# Altium project PR003.PrjPcb (part 1 of 11)
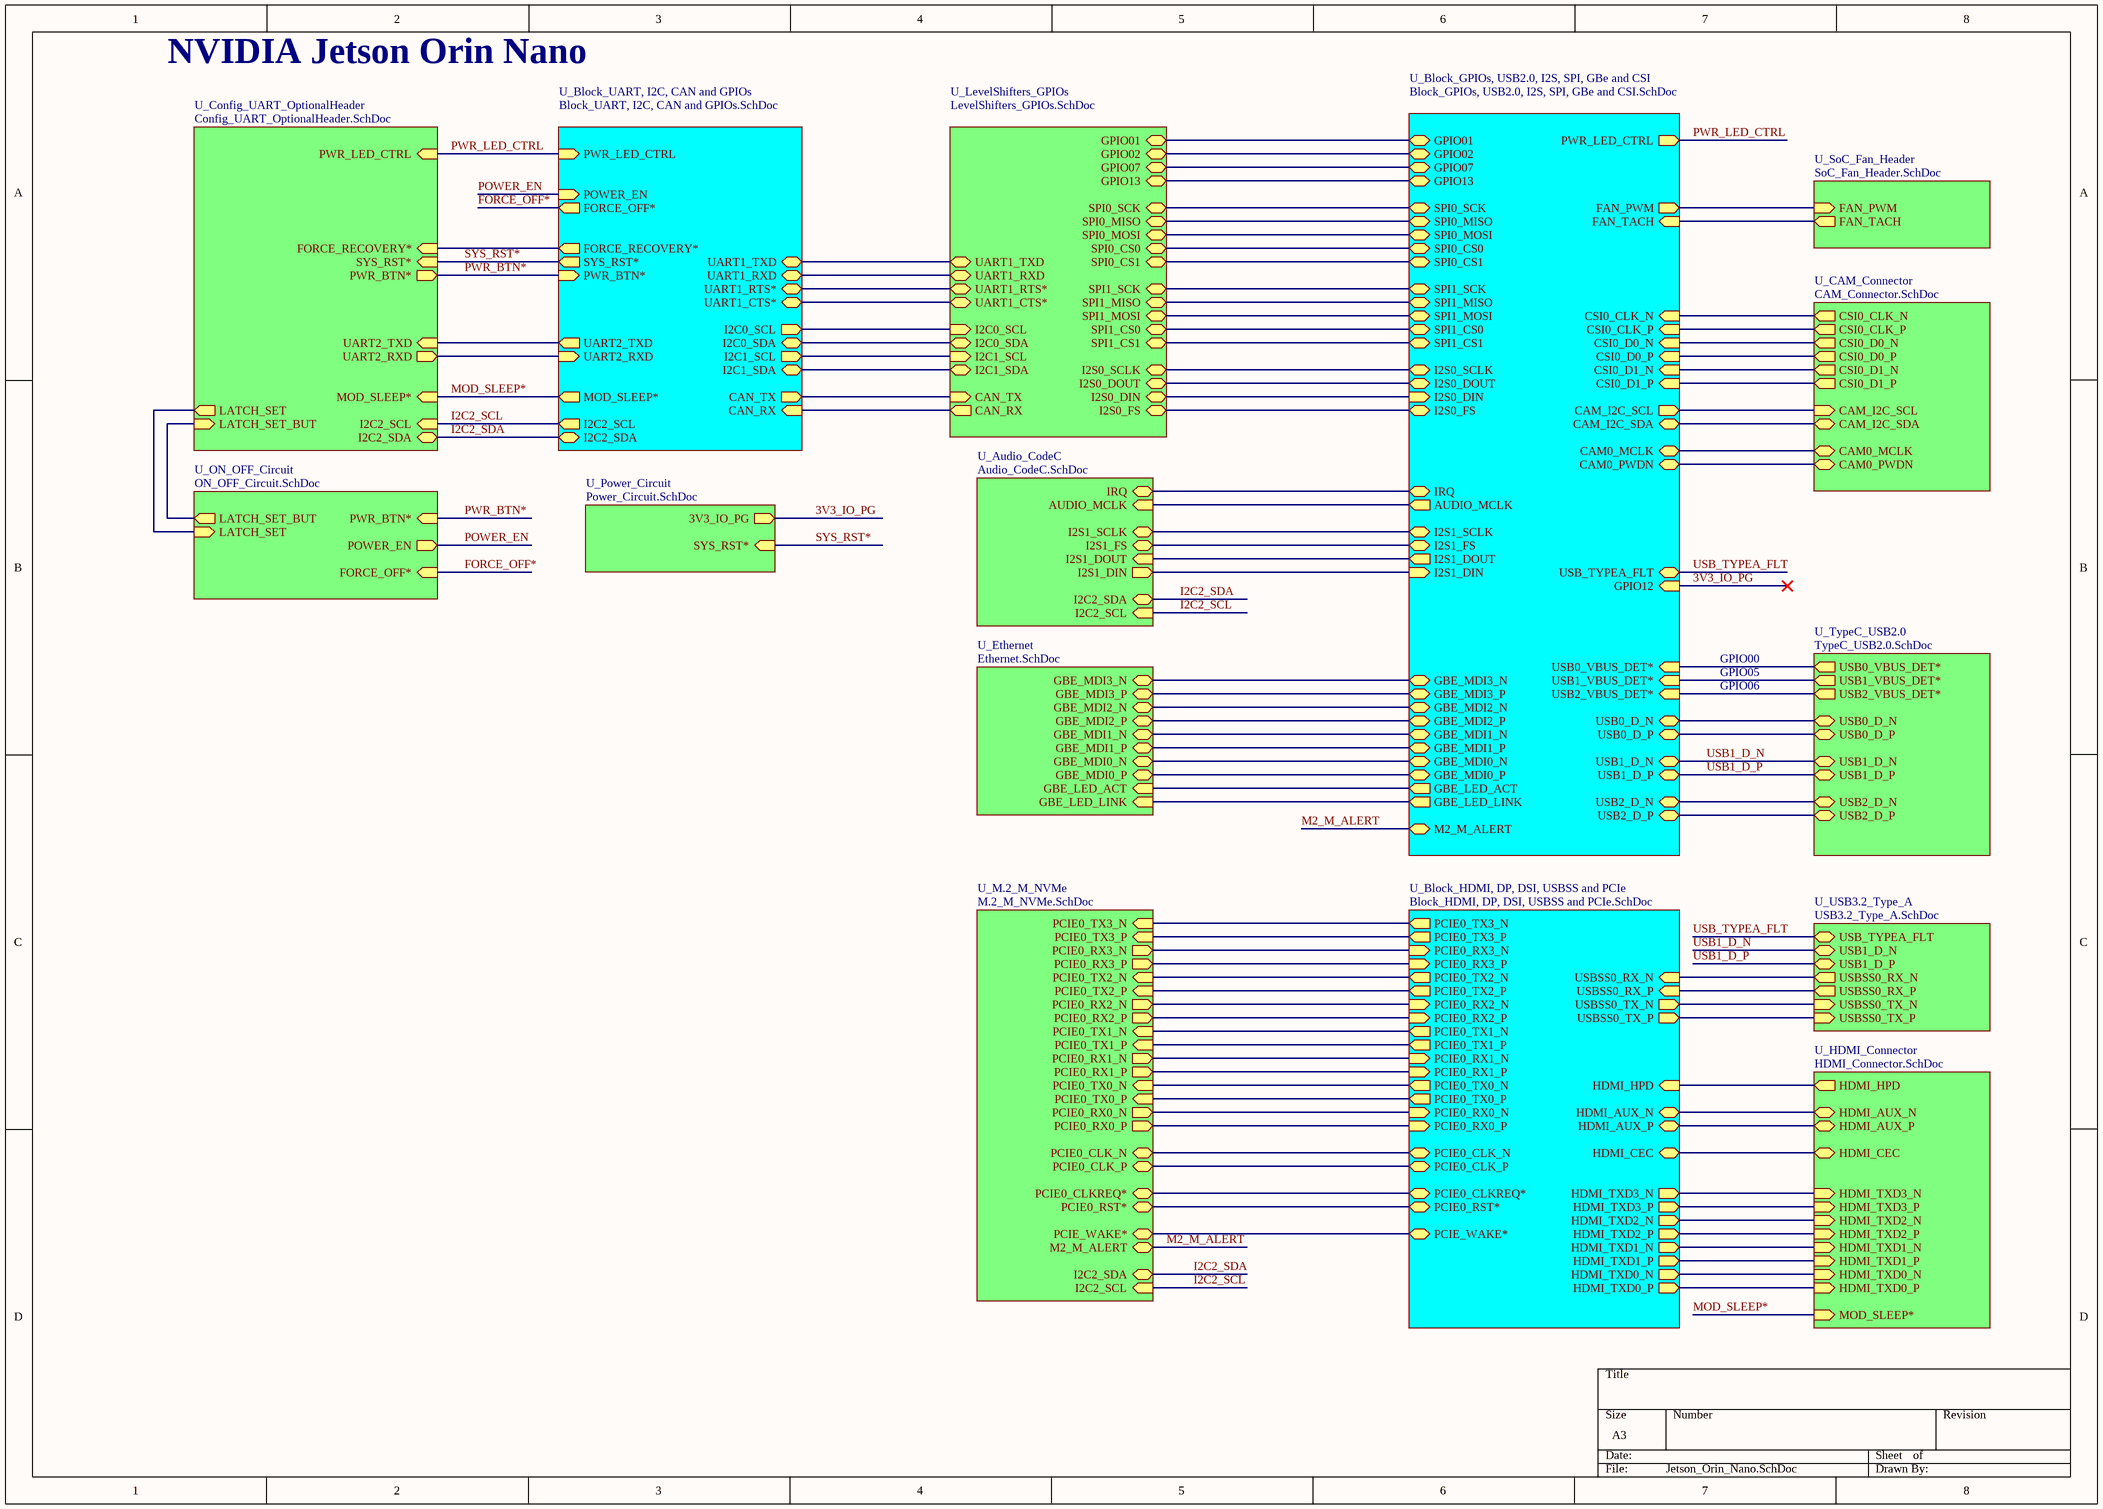
[diagram p0: Jetson_Orin_Nano.SchDoc]
16 sheets, 481 parts. Net scope: hierarchical (ports join the sheet entries above them; power ports are global).
Sheets:
  Jetson_Orin_Nano.SchDoc
    U_Block_GPIOs, USB2.0, I2S, SPI, GBe and CSI = Block_GPIOs, USB2.0, I2S, SPI, GBe and CSI.SchDoc
    U_Block_HDMI, DP, DSI, USBSS and PCIe = Block_HDMI, DP, DSI, USBSS and PCIe.SchDoc
    U_TypeC_USB2.0 = TypeC_USB2.0.SchDoc
    U_USB3.2_Type_A = USB3.2_Type_A.SchDoc
    U_M.2_M_NVMe = M.2_M_NVMe.SchDoc
    U_Ethernet = Ethernet.SchDoc
    U_HDMI_Connector = HDMI_Connector.SchDoc
    U_Block_UART, I2C, CAN and GPIOs = Block_UART, I2C, CAN and GPIOs.SchDoc
    U_Audio_CodeC = Audio_CodeC.SchDoc
    U_LevelShifters_GPIOs = LevelShifters_GPIOs.SchDoc
    U_SoC_Fan_Header = SoC_Fan_Header.SchDoc
    U_Config_UART_OptionalHeader = Config_UART_OptionalHeader.SchDoc
    U_Power_Circuit = Power_Circuit.SchDoc
    U_ON_OFF_Circuit = ON_OFF_Circuit.SchDoc
    U_CAM_Connector = CAM_Connector.SchDoc

## Sheet Jetson_Orin_Nano.SchDoc
size A3; SheetNumber: 1; SheetTotal: 16

### Sub-sheets
U_Audio_CodeC = Audio_CodeC.SchDoc: I2S1_SCLK (bidir), I2S1_DOUT (in), I2S1_FS (bidir), I2S1_DIN (out), AUDIO_MCLK (in), I2C2_SDA (bidir), I2C2_SCL (in), IRQ (bidir)
U_Block_GPIOs, USB2.0, I2S, SPI, GBe and CSI = Block_GPIOs, USB2.0, I2S, SPI, GBe and CSI.SchDoc: M2_M_ALERT (bidir), USB0_VBUS_DET* (in), I2S1_FS (bidir), I2S1_DOUT (out), I2S1_SCLK (bidir), I2S1_DIN (in), GBE_LED_LINK (out), GBE_LED_ACT (out), GBE_MDI3_N (bidir), GBE_MDI1_N (bidir), PWR_LED_CTRL (out), GPIO13 (bidir), AUDIO_MCLK (out), IRQ (bidir), SPI0_SCK (bidir), SPI0_MOSI (bidir), FAN_PWM (out), FAN_TACH (in), GPIO07 (bidir), SPI0_MISO (bidir), SPI1_SCK (bidir), SPI1_MOSI (bidir), SPI1_MISO (bidir), SPI1_CS0 (bidir), SPI1_CS1 (bidir), SPI0_CS0 (bidir), SPI0_CS1 (bidir), I2S0_FS (bidir), I2S0_SCLK (bidir), I2S0_DIN (in), I2S0_DOUT (bidir), GPIO02 (bidir), GPIO01 (bidir), CSI0_D0_P (in), CSI0_D0_N (in), CSI0_D1_P (in), CSI0_D1_N (in), CSI0_CLK_P (in), CSI0_CLK_N (in), CAM_I2C_SDA (bidir), CAM_I2C_SCL (out), CAM0_PWDN (bidir), CAM0_MCLK (bidir), USB_TYPEA_FLT (bidir), USB1_VBUS_DET* (in), USB2_VBUS_DET* (in), GPIO12 (in), GBE_MDI0_P (bidir), GBE_MDI0_N (bidir), GBE_MDI1_P (bidir), GBE_MDI2_P (bidir), GBE_MDI2_N (bidir), GBE_MDI3_P (bidir), USB2_D_N (bidir), USB1_D_P (bidir), USB0_D_N (bidir), USB0_D_P (bidir), USB2_D_P (bidir), USB1_D_N (bidir)
U_Block_HDMI, DP, DSI, USBSS and PCIe = Block_HDMI, DP, DSI, USBSS and PCIe.SchDoc: PCIE0_TX3_N (out), PCIE0_TX3_P (out), PCIE0_TX2_N (out), PCIE0_TX2_P (out), USBSS0_RX_N (in), USBSS0_TX_P (out), USBSS0_TX_N (out), USBSS0_RX_P (in), PCIE0_RX0_P (in), PCIE0_TX0_N (out), PCIE0_CLKREQ* (bidir), PCIE0_RST* (bidir), PCIE0_CLK_P (bidir), PCIE0_RX0_N (in), PCIE0_TX0_P (out), PCIE0_CLK_N (bidir), PCIE0_RX3_N (in), PCIE0_RX3_P (in), PCIE0_RX2_N (in), PCIE0_RX2_P (in), HDMI_CEC (bidir), PCIE_WAKE* (bidir), PCIE0_RX1_P (in), PCIE0_RX1_N (in), PCIE0_TX1_N (out), PCIE0_TX1_P (out), HDMI_TXD3_N (out), HDMI_TXD0_P (out), HDMI_TXD1_P (out), HDMI_AUX_P (bidir), HDMI_AUX_N (bidir), HDMI_TXD1_N (out), HDMI_TXD0_N (out), HDMI_TXD2_P (out), HDMI_HPD (in), HDMI_TXD3_P (out), HDMI_TXD2_N (out)
U_Block_UART, I2C, CAN and GPIOs = Block_UART, I2C, CAN and GPIOs.SchDoc: I2C1_SCL (out), I2C2_SCL (out), I2C1_SDA (bidir), I2C2_SDA (bidir), PWR_BTN* (in), PWR_LED_CTRL (in), UART1_TXD (bidir), UART1_RXD (bidir), UART2_TXD (out), UART2_RXD (in), CAN_RX (in), CAN_TX (out), MOD_SLEEP* (out), SYS_RST* (out), FORCE_RECOVERY* (out), I2C0_SCL (out), I2C0_SDA (bidir), UART1_RTS* (bidir), UART1_CTS* (bidir), POWER_EN (in), FORCE_OFF* (out)
U_CAM_Connector = CAM_Connector.SchDoc: CSI0_D0_N (out), CSI0_D0_P (out), CSI0_D1_N (out), CSI0_D1_P (out), CSI0_CLK_N (out), CSI0_CLK_P (out), CAM0_PWDN (bidir), CAM0_MCLK (bidir), CAM_I2C_SCL (in), CAM_I2C_SDA (bidir)
U_Config_UART_OptionalHeader = Config_UART_OptionalHeader.SchDoc: UART2_RXD (out), UART2_TXD (in), PWR_LED_CTRL (in), MOD_SLEEP* (in), SYS_RST* (in), FORCE_RECOVERY* (in), PWR_BTN* (out), I2C2_SCL (in), I2C2_SDA (bidir), LATCH_SET_BUT (in), LATCH_SET (out)
U_Ethernet = Ethernet.SchDoc: GBE_MDI0_P (bidir), GBE_MDI0_N (bidir), GBE_MDI1_P (bidir), GBE_MDI1_N (bidir), GBE_MDI2_P (bidir), GBE_MDI2_N (bidir), GBE_MDI3_P (bidir), GBE_MDI3_N (bidir), GBE_LED_LINK (in), GBE_LED_ACT (in)
U_HDMI_Connector = HDMI_Connector.SchDoc: HDMI_TXD0_P (in), HDMI_HPD (out), HDMI_AUX_N (bidir), HDMI_AUX_P (bidir), HDMI_CEC (bidir), HDMI_TXD3_N (in), HDMI_TXD3_P (in), HDMI_TXD2_N (in), HDMI_TXD2_P (in), HDMI_TXD1_N (in), HDMI_TXD1_P (in), HDMI_TXD0_N (in), MOD_SLEEP* (in)
U_LevelShifters_GPIOs = LevelShifters_GPIOs.SchDoc: SPI0_SCK (bidir), SPI0_MISO (bidir), SPI0_MOSI (bidir), SPI0_CS0 (bidir), SPI0_CS1 (bidir), SPI1_SCK (bidir), SPI1_MISO (bidir), SPI1_MOSI (bidir), SPI1_CS0 (bidir), SPI1_CS1 (bidir), I2C1_SDA (bidir), I2C1_SCL (in), I2C0_SCL (in), I2C0_SDA (bidir), CAN_TX (in), I2S0_SCLK (bidir), I2S0_FS (bidir), I2S0_DIN (bidir), CAN_RX (out), UART1_RXD (bidir), GPIO13 (bidir), GPIO01 (bidir), GPIO02 (bidir), GPIO07 (bidir), UART1_CTS* (bidir), UART1_RTS* (bidir), UART1_TXD (bidir), I2S0_DOUT (bidir)
U_M.2_M_NVMe = M.2_M_NVMe.SchDoc: PCIE0_TX0_P (in), PCIE0_TX0_N (in), PCIE0_RX1_P (out), PCIE0_RX1_N (out), PCIE0_TX1_P (in), PCIE0_TX1_N (in), PCIE0_RX2_P (out), PCIE0_RX2_N (out), PCIE0_TX2_P (in), PCIE0_TX2_N (in), PCIE0_RX3_P (out), PCIE0_RX3_N (out), PCIE0_TX3_P (in), PCIE0_TX3_N (in), PCIE0_RST* (bidir), PCIE0_CLKREQ* (bidir), I2C2_SCL (in), I2C2_SDA (bidir), PCIE_WAKE* (bidir), PCIE0_RX0_P (out), PCIE0_RX0_N (out), PCIE0_CLK_N (bidir), PCIE0_CLK_P (bidir), M2_M_ALERT (bidir)
U_ON_OFF_Circuit = ON_OFF_Circuit.SchDoc: PWR_BTN* (in), POWER_EN (out), FORCE_OFF* (in), LATCH_SET_BUT (out), LATCH_SET (in)
U_Power_Circuit = Power_Circuit.SchDoc: 3V3_IO_PG (out), SYS_RST* (in)
U_SoC_Fan_Header = SoC_Fan_Header.SchDoc: FAN_TACH (out), FAN_PWM (in)
U_TypeC_USB2.0 = TypeC_USB2.0.SchDoc: USB0_VBUS_DET* (out), USB0_D_P (bidir), USB0_D_N (bidir), USB1_VBUS_DET* (out), USB1_D_N (bidir), USB1_D_P (bidir), USB2_VBUS_DET* (out), USB2_D_N (bidir), USB2_D_P (bidir)
U_USB3.2_Type_A = USB3.2_Type_A.SchDoc: USB_TYPEA_FLT (bidir), USBSS0_RX_N (out), USBSS0_RX_P (out), USB1_D_N (bidir), USB1_D_P (bidir), USBSS0_TX_N (in), USBSS0_TX_P (in)

### Nets
3V3_IO_PG: sheet U_Block_GPIOs, USB2.0, I2S, SPI, GBe and CSI/GPIO12, sheet U_Power_Circuit/3V3_IO_PG
CAM_I2C_SCL: sheet U_Block_GPIOs, USB2.0, I2S, SPI, GBe and CSI/CAM_I2C_SCL, sheet U_CAM_Connector/CAM_I2C_SCL
CAM_I2C_SDA: sheet U_Block_GPIOs, USB2.0, I2S, SPI, GBe and CSI/CAM_I2C_SDA, sheet U_CAM_Connector/CAM_I2C_SDA
FORCE_OFF*: sheet U_Block_UART, I2C, CAN and GPIOs/FORCE_OFF*, sheet U_ON_OFF_Circuit/FORCE_OFF*
I2C0_SCL: sheet U_Block_UART, I2C, CAN and GPIOs/I2C0_SCL, sheet U_LevelShifters_GPIOs/I2C0_SCL
I2C0_SDA: sheet U_Block_UART, I2C, CAN and GPIOs/I2C0_SDA, sheet U_LevelShifters_GPIOs/I2C0_SDA
I2C1_SCL: sheet U_Block_UART, I2C, CAN and GPIOs/I2C1_SCL, sheet U_LevelShifters_GPIOs/I2C1_SCL
I2C1_SDA: sheet U_Block_UART, I2C, CAN and GPIOs/I2C1_SDA, sheet U_LevelShifters_GPIOs/I2C1_SDA
I2C2_SCL: sheet U_M.2_M_NVMe/I2C2_SCL, sheet U_Block_UART, I2C, CAN and GPIOs/I2C2_SCL, sheet U_Audio_CodeC/I2C2_SCL, sheet U_Config_UART_OptionalHeader/I2C2_SCL
I2C2_SDA: sheet U_M.2_M_NVMe/I2C2_SDA, sheet U_Block_UART, I2C, CAN and GPIOs/I2C2_SDA, sheet U_Audio_CodeC/I2C2_SDA, sheet U_Config_UART_OptionalHeader/I2C2_SDA
LATCH_SET: sheet U_Config_UART_OptionalHeader/LATCH_SET, sheet U_ON_OFF_Circuit/LATCH_SET
LATCH_SET_BUT: sheet U_Config_UART_OptionalHeader/LATCH_SET_BUT, sheet U_ON_OFF_Circuit/LATCH_SET_BUT
M2_M_ALERT: sheet U_Block_GPIOs, USB2.0, I2S, SPI, GBe and CSI/M2_M_ALERT, sheet U_M.2_M_NVMe/M2_M_ALERT
MOD_SLEEP*: sheet U_HDMI_Connector/MOD_SLEEP*, sheet U_Block_UART, I2C, CAN and GPIOs/MOD_SLEEP*, sheet U_Config_UART_OptionalHeader/MOD_SLEEP*
POWER_EN: sheet U_Block_UART, I2C, CAN and GPIOs/POWER_EN, sheet U_ON_OFF_Circuit/POWER_EN
PWR_BTN*: sheet U_Block_UART, I2C, CAN and GPIOs/PWR_BTN*, sheet U_Config_UART_OptionalHeader/PWR_BTN*, sheet U_ON_OFF_Circuit/PWR_BTN*
PWR_LED_CTRL: sheet U_Block_GPIOs, USB2.0, I2S, SPI, GBe and CSI/PWR_LED_CTRL, sheet U_Block_UART, I2C, CAN and GPIOs/PWR_LED_CTRL, sheet U_Config_UART_OptionalHeader/PWR_LED_CTRL
SYS_RST*: sheet U_Block_UART, I2C, CAN and GPIOs/SYS_RST*, sheet U_Config_UART_OptionalHeader/SYS_RST*, sheet U_Power_Circuit/SYS_RST*
USB0_AP_N: sheet U_Block_GPIOs, USB2.0, I2S, SPI, GBe and CSI/USB0_D_N, sheet U_TypeC_USB2.0/USB0_D_N
USB0_AP_P: sheet U_Block_GPIOs, USB2.0, I2S, SPI, GBe and CSI/USB0_D_P, sheet U_TypeC_USB2.0/USB0_D_P
USB1_D_N: sheet U_Block_GPIOs, USB2.0, I2S, SPI, GBe and CSI/USB1_D_N, sheet U_TypeC_USB2.0/USB1_D_N, sheet U_USB3.2_Type_A/USB1_D_N
USB1_D_P: sheet U_Block_GPIOs, USB2.0, I2S, SPI, GBe and CSI/USB1_D_P, sheet U_TypeC_USB2.0/USB1_D_P, sheet U_USB3.2_Type_A/USB1_D_P
USB2_AP_N: sheet U_Block_GPIOs, USB2.0, I2S, SPI, GBe and CSI/USB2_D_N, sheet U_TypeC_USB2.0/USB2_D_N
USB2_AP_P: sheet U_Block_GPIOs, USB2.0, I2S, SPI, GBe and CSI/USB2_D_P, sheet U_TypeC_USB2.0/USB2_D_P
USB_TYPEA_FLT: sheet U_Block_GPIOs, USB2.0, I2S, SPI, GBe and CSI/USB_TYPEA_FLT, sheet U_USB3.2_Type_A/USB_TYPEA_FLT
USBSS0_B_TX_N: sheet U_Block_HDMI, DP, DSI, USBSS and PCIe/USBSS0_TX_N, sheet U_USB3.2_Type_A/USBSS0_TX_N
USBSS0_B_TX_P: sheet U_Block_HDMI, DP, DSI, USBSS and PCIe/USBSS0_TX_P, sheet U_USB3.2_Type_A/USBSS0_TX_P
USBSS0_RX_N: sheet U_Block_HDMI, DP, DSI, USBSS and PCIe/USBSS0_RX_N, sheet U_USB3.2_Type_A/USBSS0_RX_N
USBSS0_RX_P: sheet U_Block_HDMI, DP, DSI, USBSS and PCIe/USBSS0_RX_P, sheet U_USB3.2_Type_A/USBSS0_RX_P
NetC42_1: sheet U_Block_HDMI, DP, DSI, USBSS and PCIe/HDMI_TXD3_N, sheet U_HDMI_Connector/HDMI_TXD3_N
NetC44_1: sheet U_Block_HDMI, DP, DSI, USBSS and PCIe/HDMI_TXD3_P, sheet U_HDMI_Connector/HDMI_TXD3_P
NetC45_1: sheet U_Block_HDMI, DP, DSI, USBSS and PCIe/HDMI_TXD2_N, sheet U_HDMI_Connector/HDMI_TXD2_N
NetC46_1: sheet U_Block_HDMI, DP, DSI, USBSS and PCIe/HDMI_TXD2_P, sheet U_HDMI_Connector/HDMI_TXD2_P
NetC47_1: sheet U_Block_HDMI, DP, DSI, USBSS and PCIe/HDMI_TXD1_N, sheet U_HDMI_Connector/HDMI_TXD1_N
NetC48_1: sheet U_Block_HDMI, DP, DSI, USBSS and PCIe/HDMI_TXD1_P, sheet U_HDMI_Connector/HDMI_TXD1_P
NetC49_1: sheet U_Block_HDMI, DP, DSI, USBSS and PCIe/HDMI_TXD0_N, sheet U_HDMI_Connector/HDMI_TXD0_N
NetC50_1: sheet U_Block_HDMI, DP, DSI, USBSS and PCIe/HDMI_TXD0_P, sheet U_HDMI_Connector/HDMI_TXD0_P
NetC135_2: sheet U_Block_HDMI, DP, DSI, USBSS and PCIe/PCIE0_TX0_P, sheet U_M.2_M_NVMe/PCIE0_TX0_P
NetC136_2: sheet U_Block_HDMI, DP, DSI, USBSS and PCIe/PCIE0_TX0_N, sheet U_M.2_M_NVMe/PCIE0_TX0_N
NetC137_2: sheet U_Block_HDMI, DP, DSI, USBSS and PCIe/PCIE0_TX1_P, sheet U_M.2_M_NVMe/PCIE0_TX1_P
NetC138_2: sheet U_Block_HDMI, DP, DSI, USBSS and PCIe/PCIE0_TX1_N, sheet U_M.2_M_NVMe/PCIE0_TX1_N
NetC139_2: sheet U_Block_HDMI, DP, DSI, USBSS and PCIe/PCIE0_TX2_P, sheet U_M.2_M_NVMe/PCIE0_TX2_P
NetC140_2: sheet U_Block_HDMI, DP, DSI, USBSS and PCIe/PCIE0_TX2_N, sheet U_M.2_M_NVMe/PCIE0_TX2_N
NetC141_2: sheet U_Block_HDMI, DP, DSI, USBSS and PCIe/PCIE0_TX3_P, sheet U_M.2_M_NVMe/PCIE0_TX3_P
NetC142_2: sheet U_Block_HDMI, DP, DSI, USBSS and PCIe/PCIE0_TX3_N, sheet U_M.2_M_NVMe/PCIE0_TX3_N
NetD14_1: sheet U_Block_HDMI, DP, DSI, USBSS and PCIe/HDMI_CEC, sheet U_HDMI_Connector/HDMI_CEC
NetD20_A: sheet U_Block_GPIOs, USB2.0, I2S, SPI, GBe and CSI/CSI0_D0_N, sheet U_CAM_Connector/CSI0_D0_N
NetD21_A: sheet U_Block_GPIOs, USB2.0, I2S, SPI, GBe and CSI/CSI0_D0_P, sheet U_CAM_Connector/CSI0_D0_P
NetD22_A: sheet U_Block_GPIOs, USB2.0, I2S, SPI, GBe and CSI/CSI0_D1_N, sheet U_CAM_Connector/CSI0_D1_N
NetD23_A: sheet U_Block_GPIOs, USB2.0, I2S, SPI, GBe and CSI/CSI0_D1_P, sheet U_CAM_Connector/CSI0_D1_P
NetD24_A: sheet U_Block_GPIOs, USB2.0, I2S, SPI, GBe and CSI/CSI0_CLK_N, sheet U_CAM_Connector/CSI0_CLK_N
NetD25_A: sheet U_Block_GPIOs, USB2.0, I2S, SPI, GBe and CSI/CSI0_CLK_P, sheet U_CAM_Connector/CSI0_CLK_P
NetD26_A: sheet U_Block_GPIOs, USB2.0, I2S, SPI, GBe and CSI/CAM0_PWDN, sheet U_CAM_Connector/CAM0_PWDN
NetD27_A: sheet U_Block_GPIOs, USB2.0, I2S, SPI, GBe and CSI/CAM0_MCLK, sheet U_CAM_Connector/CAM0_MCLK
NetD47_2: sheet U_Block_UART, I2C, CAN and GPIOs/FORCE_RECOVERY*, sheet U_Config_UART_OptionalHeader/FORCE_RECOVERY*
NetJ5_1: sheet U_Block_GPIOs, USB2.0, I2S, SPI, GBe and CSI/GBE_MDI0_P, sheet U_Ethernet/GBE_MDI0_P
NetJ5_2: sheet U_Block_GPIOs, USB2.0, I2S, SPI, GBe and CSI/GBE_MDI0_N, sheet U_Ethernet/GBE_MDI0_N
NetJ5_3: sheet U_Block_GPIOs, USB2.0, I2S, SPI, GBe and CSI/GBE_MDI1_P, sheet U_Ethernet/GBE_MDI1_P
NetJ5_6: sheet U_Block_GPIOs, USB2.0, I2S, SPI, GBe and CSI/GBE_MDI1_N, sheet U_Ethernet/GBE_MDI1_N
NetJ5_7: sheet U_Block_GPIOs, USB2.0, I2S, SPI, GBe and CSI/GBE_MDI2_P, sheet U_Ethernet/GBE_MDI2_P
NetJ5_8: sheet U_Block_GPIOs, USB2.0, I2S, SPI, GBe and CSI/GBE_MDI2_N, sheet U_Ethernet/GBE_MDI2_N
NetJ5_9: sheet U_Block_GPIOs, USB2.0, I2S, SPI, GBe and CSI/GBE_MDI3_P, sheet U_Ethernet/GBE_MDI3_P
NetJ5_10: sheet U_Block_GPIOs, USB2.0, I2S, SPI, GBe and CSI/GBE_MDI3_N, sheet U_Ethernet/GBE_MDI3_N
NetJ10_87: sheet U_Block_GPIOs, USB2.0, I2S, SPI, GBe and CSI/USB0_VBUS_DET*, sheet U_TypeC_USB2.0/USB0_VBUS_DET*
NetJ10_89: sheet U_Block_GPIOs, USB2.0, I2S, SPI, GBe and CSI/SPI0_MOSI, sheet U_LevelShifters_GPIOs/SPI0_MOSI
NetJ10_91: sheet U_Block_GPIOs, USB2.0, I2S, SPI, GBe and CSI/SPI0_SCK, sheet U_LevelShifters_GPIOs/SPI0_SCK
NetJ10_93: sheet U_Block_GPIOs, USB2.0, I2S, SPI, GBe and CSI/SPI0_MISO, sheet U_LevelShifters_GPIOs/SPI0_MISO
NetJ10_95: sheet U_Block_GPIOs, USB2.0, I2S, SPI, GBe and CSI/SPI0_CS0, sheet U_LevelShifters_GPIOs/SPI0_CS0
NetJ10_96: sheet U_Block_HDMI, DP, DSI, USBSS and PCIe/HDMI_HPD, sheet U_HDMI_Connector/HDMI_HPD
NetJ10_97: sheet U_Block_GPIOs, USB2.0, I2S, SPI, GBe and CSI/SPI0_CS1, sheet U_LevelShifters_GPIOs/SPI0_CS1
NetJ10_98: sheet U_Block_HDMI, DP, DSI, USBSS and PCIe/HDMI_AUX_N, sheet U_HDMI_Connector/HDMI_AUX_N
NetJ10_100: sheet U_Block_HDMI, DP, DSI, USBSS and PCIe/HDMI_AUX_P, sheet U_HDMI_Connector/HDMI_AUX_P
NetJ10_104: sheet U_Block_GPIOs, USB2.0, I2S, SPI, GBe and CSI/SPI1_MOSI, sheet U_LevelShifters_GPIOs/SPI1_MOSI
NetJ10_106: sheet U_Block_GPIOs, USB2.0, I2S, SPI, GBe and CSI/SPI1_SCK, sheet U_LevelShifters_GPIOs/SPI1_SCK
NetJ10_108: sheet U_Block_GPIOs, USB2.0, I2S, SPI, GBe and CSI/SPI1_MISO, sheet U_LevelShifters_GPIOs/SPI1_MISO
NetJ10_110: sheet U_Block_GPIOs, USB2.0, I2S, SPI, GBe and CSI/SPI1_CS0, sheet U_LevelShifters_GPIOs/SPI1_CS0
NetJ10_112: sheet U_Block_GPIOs, USB2.0, I2S, SPI, GBe and CSI/SPI1_CS1, sheet U_LevelShifters_GPIOs/SPI1_CS1
NetJ10_118: sheet U_Block_GPIOs, USB2.0, I2S, SPI, GBe and CSI/GPIO01, sheet U_LevelShifters_GPIOs/GPIO01
NetJ10_124: sheet U_Block_GPIOs, USB2.0, I2S, SPI, GBe and CSI/GPIO02, sheet U_LevelShifters_GPIOs/GPIO02
NetJ10_128: sheet U_Block_GPIOs, USB2.0, I2S, SPI, GBe and CSI/USB1_VBUS_DET*, sheet U_TypeC_USB2.0/USB1_VBUS_DET*
NetJ10_130: sheet U_Block_GPIOs, USB2.0, I2S, SPI, GBe and CSI/USB2_VBUS_DET*, sheet U_TypeC_USB2.0/USB2_VBUS_DET*
NetJ10_131: sheet U_Block_HDMI, DP, DSI, USBSS and PCIe/PCIE0_RX0_N, sheet U_M.2_M_NVMe/PCIE0_RX0_N
NetJ10_133: sheet U_Block_HDMI, DP, DSI, USBSS and PCIe/PCIE0_RX0_P, sheet U_M.2_M_NVMe/PCIE0_RX0_P
NetJ10_137: sheet U_Block_HDMI, DP, DSI, USBSS and PCIe/PCIE0_RX1_N, sheet U_M.2_M_NVMe/PCIE0_RX1_N
NetJ10_139: sheet U_Block_HDMI, DP, DSI, USBSS and PCIe/PCIE0_RX1_P, sheet U_M.2_M_NVMe/PCIE0_RX1_P
NetJ10_143: sheet U_Block_UART, I2C, CAN and GPIOs/CAN_RX, sheet U_LevelShifters_GPIOs/CAN_RX
NetJ10_145: sheet U_Block_UART, I2C, CAN and GPIOs/CAN_TX, sheet U_LevelShifters_GPIOs/CAN_TX
NetJ10_149: sheet U_Block_HDMI, DP, DSI, USBSS and PCIe/PCIE0_RX2_N, sheet U_M.2_M_NVMe/PCIE0_RX2_N
NetJ10_151: sheet U_Block_HDMI, DP, DSI, USBSS and PCIe/PCIE0_RX2_P, sheet U_M.2_M_NVMe/PCIE0_RX2_P
NetJ10_155: sheet U_Block_HDMI, DP, DSI, USBSS and PCIe/PCIE0_RX3_N, sheet U_M.2_M_NVMe/PCIE0_RX3_N
NetJ10_157: sheet U_Block_HDMI, DP, DSI, USBSS and PCIe/PCIE0_RX3_P, sheet U_M.2_M_NVMe/PCIE0_RX3_P
NetJ10_160: sheet U_Block_HDMI, DP, DSI, USBSS and PCIe/PCIE0_CLK_N, sheet U_M.2_M_NVMe/PCIE0_CLK_N
NetJ10_162: sheet U_Block_HDMI, DP, DSI, USBSS and PCIe/PCIE0_CLK_P, sheet U_M.2_M_NVMe/PCIE0_CLK_P
NetJ10_179: sheet U_Block_HDMI, DP, DSI, USBSS and PCIe/PCIE_WAKE*, sheet U_M.2_M_NVMe/PCIE_WAKE*
NetJ10_180: sheet U_Block_HDMI, DP, DSI, USBSS and PCIe/PCIE0_CLKREQ*, sheet U_M.2_M_NVMe/PCIE0_CLKREQ*
NetJ10_181: sheet U_Block_HDMI, DP, DSI, USBSS and PCIe/PCIE0_RST*, sheet U_M.2_M_NVMe/PCIE0_RST*
NetJ10_188: sheet U_Block_GPIOs, USB2.0, I2S, SPI, GBe and CSI/GBE_LED_LINK, sheet U_Ethernet/GBE_LED_LINK
NetJ10_193: sheet U_Block_GPIOs, USB2.0, I2S, SPI, GBe and CSI/I2S0_DOUT, sheet U_LevelShifters_GPIOs/I2S0_DOUT
NetJ10_194: sheet U_Block_GPIOs, USB2.0, I2S, SPI, GBe and CSI/GBE_LED_ACT, sheet U_Ethernet/GBE_LED_ACT
NetJ10_195: sheet U_Block_GPIOs, USB2.0, I2S, SPI, GBe and CSI/I2S0_DIN, sheet U_LevelShifters_GPIOs/I2S0_DIN
NetJ10_197: sheet U_Block_GPIOs, USB2.0, I2S, SPI, GBe and CSI/I2S0_FS, sheet U_LevelShifters_GPIOs/I2S0_FS
NetJ10_199: sheet U_Block_GPIOs, USB2.0, I2S, SPI, GBe and CSI/I2S0_SCLK, sheet U_LevelShifters_GPIOs/I2S0_SCLK
NetJ10_203: sheet U_Block_UART, I2C, CAN and GPIOs/UART1_TXD, sheet U_LevelShifters_GPIOs/UART1_TXD
NetJ10_205: sheet U_Block_UART, I2C, CAN and GPIOs/UART1_RXD, sheet U_LevelShifters_GPIOs/UART1_RXD
NetJ10_206: sheet U_Block_GPIOs, USB2.0, I2S, SPI, GBe and CSI/GPIO07, sheet U_LevelShifters_GPIOs/GPIO07
NetJ10_207: sheet U_Block_UART, I2C, CAN and GPIOs/UART1_RTS*, sheet U_LevelShifters_GPIOs/UART1_RTS*
NetJ10_208: sheet U_Block_GPIOs, USB2.0, I2S, SPI, GBe and CSI/FAN_TACH, sheet U_SoC_Fan_Header/FAN_TACH
NetJ10_209: sheet U_Block_UART, I2C, CAN and GPIOs/UART1_CTS*, sheet U_LevelShifters_GPIOs/UART1_CTS*
NetJ10_211: sheet U_Block_GPIOs, USB2.0, I2S, SPI, GBe and CSI/AUDIO_MCLK, sheet U_Audio_CodeC/AUDIO_MCLK
NetJ10_216: sheet U_Block_GPIOs, USB2.0, I2S, SPI, GBe and CSI/IRQ, sheet U_Audio_CodeC/IRQ
NetJ10_220: sheet U_Block_GPIOs, USB2.0, I2S, SPI, GBe and CSI/I2S1_DOUT, sheet U_Audio_CodeC/I2S1_DOUT
NetJ10_222: sheet U_Block_GPIOs, USB2.0, I2S, SPI, GBe and CSI/I2S1_DIN, sheet U_Audio_CodeC/I2S1_DIN
NetJ10_224: sheet U_Block_GPIOs, USB2.0, I2S, SPI, GBe and CSI/I2S1_FS, sheet U_Audio_CodeC/I2S1_FS
NetJ10_226: sheet U_Block_GPIOs, USB2.0, I2S, SPI, GBe and CSI/I2S1_SCLK, sheet U_Audio_CodeC/I2S1_SCLK
NetJ10_228: sheet U_Block_GPIOs, USB2.0, I2S, SPI, GBe and CSI/GPIO13, sheet U_LevelShifters_GPIOs/GPIO13
NetJ10_230: sheet U_Block_GPIOs, USB2.0, I2S, SPI, GBe and CSI/FAN_PWM, sheet U_SoC_Fan_Header/FAN_PWM
NetJ10_236: sheet U_Block_UART, I2C, CAN and GPIOs/UART2_TXD, sheet U_Config_UART_OptionalHeader/UART2_TXD
NetJ10_238: sheet U_Block_UART, I2C, CAN and GPIOs/UART2_RXD, sheet U_Config_UART_OptionalHeader/UART2_RXD

### Notes on the sheet
- NVIDIA Jetson Orin Nano
- GPIO00
- GPIO05
- GPIO06

## Sheet Block_GPIOs, USB2.0, I2S, SPI, GBe and CSI.SchDoc
size A3; SheetNumber: 3; SheetTotal: 16
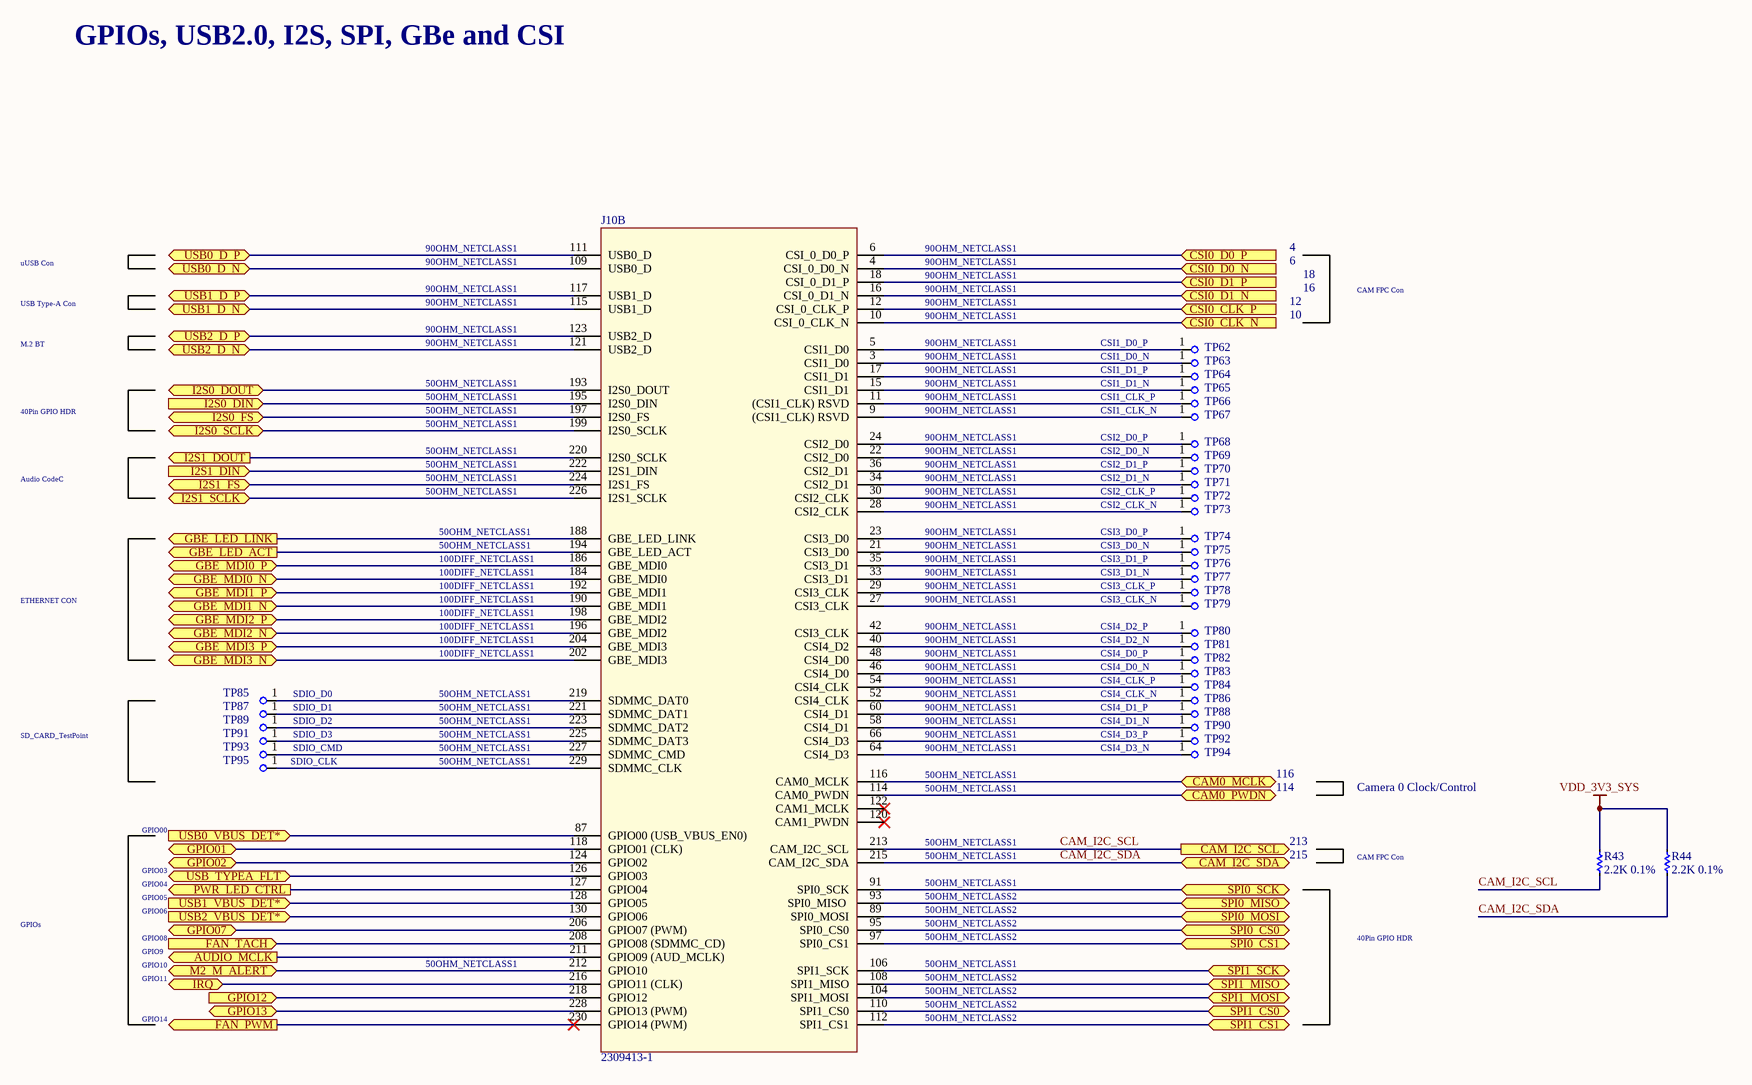
[diagram p1: Block_GPIOs, USB2.0, I2S, SPI, GBe and CSI.SchDoc]

### Parts
J10  2309413-1  [2309413-1]  (part B of 3)
R43  2.2K 0.1%  [R0603]
R44  2.2K 0.1%  [R0603]
TP62  CSI1_D0_P  [TestPoint_Pad_D1.0mm]
TP63  CSI1_D0_N  [TestPoint_Pad_D1.0mm]
TP64  CSI1_D1_P  [TestPoint_Pad_D1.0mm]
TP65  CSI1_D1_N  [TestPoint_Pad_D1.0mm]
TP66  CSI1_CLK_P  [TestPoint_Pad_D1.0mm]
TP67  CSI1_CLK_N  [TestPoint_Pad_D1.0mm]
TP68  CSI2_D0_P  [TestPoint_Pad_D1.0mm]
TP69  CSI2_D0_N  [TestPoint_Pad_D1.0mm]
TP70  CSI2_D1_P  [TestPoint_Pad_D1.0mm]
TP71  CSI2_D1_N  [TestPoint_Pad_D1.0mm]
TP72  CSI2_CLK_P  [TestPoint_Pad_D1.0mm]
TP73  CSI2_CLK_N  [TestPoint_Pad_D1.0mm]
TP74  CSI3_D0_P  [TestPoint_Pad_D1.0mm]
TP75  CSI3_D0_N  [TestPoint_Pad_D1.0mm]
TP76  CSI3_D1_P  [TestPoint_Pad_D1.0mm]
TP77  CSI3_D1_N  [TestPoint_Pad_D1.0mm]
TP78  CSI3_CLK_P  [TestPoint_Pad_D1.0mm]
TP79  CSI3_CLK_N  [TestPoint_Pad_D1.0mm]
TP80  CSI4_D2_P  [TestPoint_Pad_D1.0mm]
TP81  CSI4_D2_N  [TestPoint_Pad_D1.0mm]
TP82  CSI4_D0_P  [TestPoint_Pad_D1.0mm]
TP83  CSI4_D0_N  [TestPoint_Pad_D1.0mm]
TP84  CSI4_CLK_P  [TestPoint_Pad_D1.0mm]
TP85  SDIO_D0  [TestPoint_Pad_D1.0mm]
TP86  CSI4_CLK_N  [TestPoint_Pad_D1.0mm]
TP87  SDIO_D1  [TestPoint_Pad_D1.0mm]
TP88  CSI4_D1_P  [TestPoint_Pad_D1.0mm]
TP89  SDIO_D2  [TestPoint_Pad_D1.0mm]
TP90  CSI4_D1_N  [TestPoint_Pad_D1.0mm]
TP91  SDIO_D3  [TestPoint_Pad_D1.0mm]
TP92  CSI4_D3_P  [TestPoint_Pad_D1.0mm]
TP93  SDIO_CMD  [TestPoint_Pad_D1.0mm]
TP94  CSI4_D3_N  [TestPoint_Pad_D1.0mm]
TP95  SDIO_CLK  [TestPoint_Pad_D1.0mm]

### Ports
AUDIO_MCLK (out), CAM0_MCLK (bidir), CAM0_PWDN (bidir), CAM_I2C_SCL (out), CAM_I2C_SDA (bidir), CSI0_CLK_N (in), CSI0_CLK_P (in), CSI0_D0_N (in), CSI0_D0_P (in), CSI0_D1_N (in), CSI0_D1_P (in), FAN_PWM (out), FAN_TACH (in), GBE_LED_ACT (out), GBE_LED_LINK (out), GBE_MDI0_N (bidir), GBE_MDI0_P (bidir), GBE_MDI1_N (bidir), GBE_MDI1_P (bidir), GBE_MDI2_N (bidir), GBE_MDI2_P (bidir), GBE_MDI3_N (bidir), GBE_MDI3_P (bidir), GPIO01 (bidir), GPIO02 (bidir), GPIO07 (bidir), GPIO12 (in), GPIO13 (bidir), I2S0_DIN (in), I2S0_DOUT (bidir), I2S0_FS (bidir), I2S0_SCLK (bidir), I2S1_DIN (in), I2S1_DOUT (out), I2S1_FS (bidir), I2S1_SCLK (bidir), IRQ (bidir), M2_M_ALERT (bidir), PWR_LED_CTRL (out), SPI0_CS0 (bidir), SPI0_CS1 (bidir), SPI0_MISO (bidir), SPI0_MOSI (bidir), SPI0_SCK (bidir), SPI1_CS0 (bidir), SPI1_CS1 (bidir), SPI1_MISO (bidir), SPI1_MOSI (bidir), SPI1_SCK (bidir), USB0_D_N (bidir), USB0_D_P (bidir), USB0_VBUS_DET* (in), USB1_D_N (bidir), USB1_D_P (bidir), USB1_VBUS_DET* (in), USB2_D_N (bidir), USB2_D_P (bidir), USB2_VBUS_DET* (in), USB_TYPEA_FLT (bidir)

### Nets
VDD_3V3_SYS: R43.2 R44.2
3V3_IO_PG: J10.218(GPIO12) ; port GPIO12
CAM_I2C_SCL: J10.213(CAM_I2C_SCL) R43.1 ; port CAM_I2C_SCL
CAM_I2C_SDA: J10.215(CAM_I2C_SDA) R44.1 ; port CAM_I2C_SDA
M2_M_ALERT: J10.212(GPIO10) ; port M2_M_ALERT
PWR_LED_CTRL: J10.127(GPIO04) ; port PWR_LED_CTRL
USB0_AP_N: J10.109(USB0_D) ; port USB0_D_N
USB0_AP_P: J10.111(USB0_D) ; port USB0_D_P
USB1_D_N: J10.115(USB1_D) ; port USB1_D_N
USB1_D_P: J10.117(USB1_D) ; port USB1_D_P
USB2_AP_N: J10.121(USB2_D) ; port USB2_D_N
USB2_AP_P: J10.123(USB2_D) ; port USB2_D_P
USB_TYPEA_FLT: J10.126(GPIO03) ; port USB_TYPEA_FLT
NetD20_A: J10.4(CSI_0_D0_N) ; port CSI0_D0_N
NetD21_A: J10.6(CSI_0_D0_P) ; port CSI0_D0_P
NetD22_A: J10.16(CSI_0_D1_N) ; port CSI0_D1_N
NetD23_A: J10.18(CSI_0_D1_P) ; port CSI0_D1_P
NetD24_A: J10.10(CSI_0_CLK_N) ; port CSI0_CLK_N
NetD25_A: J10.12(CSI_0_CLK_P) ; port CSI0_CLK_P
NetD26_A: J10.114(CAM0_PWDN) ; port CAM0_PWDN
NetD27_A: J10.116(CAM0_MCLK) ; port CAM0_MCLK
NetJ5_1: J10.186(GBE_MDI0) ; port GBE_MDI0_P
NetJ5_2: J10.184(GBE_MDI0) ; port GBE_MDI0_N
NetJ5_3: J10.192(GBE_MDI1) ; port GBE_MDI1_P
NetJ5_6: J10.190(GBE_MDI1) ; port GBE_MDI1_N
NetJ5_7: J10.198(GBE_MDI2) ; port GBE_MDI2_P
NetJ5_8: J10.196(GBE_MDI2) ; port GBE_MDI2_N
NetJ5_9: J10.204(GBE_MDI3) ; port GBE_MDI3_P
NetJ5_10: J10.202(GBE_MDI3) ; port GBE_MDI3_N
NetJ10_3: J10.3(CSI1_D0) TP63.1
NetJ10_5: J10.5(CSI1_D0) TP62.1
NetJ10_9: J10.9((CSI1_CLK)_RSVD) TP67.1
NetJ10_11: J10.11((CSI1_CLK)_RSVD) TP66.1
NetJ10_15: J10.15(CSI1_D1) TP65.1
NetJ10_17: J10.17(CSI1_D1) TP64.1
NetJ10_21: J10.21(CSI3_D0) TP75.1
NetJ10_22: J10.22(CSI2_D0) TP69.1
NetJ10_23: J10.23(CSI3_D0) TP74.1
NetJ10_24: J10.24(CSI2_D0) TP68.1
NetJ10_27: J10.27(CSI3_CLK) TP79.1
NetJ10_28: J10.28(CSI2_CLK) TP73.1
NetJ10_29: J10.29(CSI3_CLK) TP78.1
NetJ10_30: J10.30(CSI2_CLK) TP72.1
NetJ10_33: J10.33(CSI3_D1) TP77.1
NetJ10_34: J10.34(CSI2_D1) TP71.1
NetJ10_35: J10.35(CSI3_D1) TP76.1
NetJ10_36: J10.36(CSI2_D1) TP70.1
NetJ10_40: J10.40(CSI4_D2) TP81.1
NetJ10_42: J10.42(CSI3_CLK) TP80.1
NetJ10_46: J10.46(CSI4_D0) TP83.1
NetJ10_48: J10.48(CSI4_D0) TP82.1
NetJ10_52: J10.52(CSI4_CLK) TP86.1
NetJ10_54: J10.54(CSI4_CLK) TP84.1
NetJ10_58: J10.58(CSI4_D1) TP90.1
NetJ10_60: J10.60(CSI4_D1) TP88.1
NetJ10_64: J10.64(CSI4_D3) TP94.1
NetJ10_66: J10.66(CSI4_D3) TP92.1
NetJ10_87: J10.87(GPIO00_(USB_VBUS_EN0)) ; port USB0_VBUS_DET*
NetJ10_89: J10.89(SPI0_MOSI) ; port SPI0_MOSI
NetJ10_91: J10.91(SPI0_SCK) ; port SPI0_SCK
NetJ10_93: J10.93(SPI0_MISO) ; port SPI0_MISO
NetJ10_95: J10.95(SPI0_CS0) ; port SPI0_CS0
NetJ10_97: J10.97(SPI0_CS1) ; port SPI0_CS1
NetJ10_104: J10.104(SPI1_MOSI) ; port SPI1_MOSI
NetJ10_106: J10.106(SPI1_SCK) ; port SPI1_SCK
NetJ10_108: J10.108(SPI1_MISO) ; port SPI1_MISO
NetJ10_110: J10.110(SPI1_CS0) ; port SPI1_CS0
NetJ10_112: J10.112(SPI1_CS1) ; port SPI1_CS1
NetJ10_118: J10.118(GPIO01_(CLK)) ; port GPIO01
NetJ10_124: J10.124(GPIO02) ; port GPIO02
NetJ10_128: J10.128(GPIO05) ; port USB1_VBUS_DET*
NetJ10_130: J10.130(GPIO06) ; port USB2_VBUS_DET*
NetJ10_188: J10.188(GBE_LED_LINK) ; port GBE_LED_LINK
NetJ10_193: J10.193(I2S0_DOUT) ; port I2S0_DOUT
NetJ10_194: J10.194(GBE_LED_ACT) ; port GBE_LED_ACT
NetJ10_195: J10.195(I2S0_DIN) ; port I2S0_DIN
NetJ10_197: J10.197(I2S0_FS) ; port I2S0_FS
NetJ10_199: J10.199(I2S0_SCLK) ; port I2S0_SCLK
NetJ10_206: J10.206(GPIO07_(PWM)) ; port GPIO07
NetJ10_208: J10.208(GPIO08_(SDMMC_CD)) ; port FAN_TACH
NetJ10_211: J10.211(GPIO09_(AUD_MCLK)) ; port AUDIO_MCLK
NetJ10_216: J10.216(GPIO11_(CLK)) ; port IRQ
NetJ10_219: J10.219(SDMMC_DAT0) TP85.1
NetJ10_220: J10.220(I2S0_SCLK) ; port I2S1_DOUT
NetJ10_221: J10.221(SDMMC_DAT1) TP87.1
NetJ10_222: J10.222(I2S1_DIN) ; port I2S1_DIN
NetJ10_223: J10.223(SDMMC_DAT2) TP89.1
NetJ10_224: J10.224(I2S1_FS) ; port I2S1_FS
NetJ10_225: J10.225(SDMMC_DAT3) TP91.1
NetJ10_226: J10.226(I2S1_SCLK) ; port I2S1_SCLK
NetJ10_227: J10.227(SDMMC_CMD) TP93.1
NetJ10_228: J10.228(GPIO13_(PWM)) ; port GPIO13
NetJ10_229: J10.229(SDMMC_CLK) TP95.1
NetJ10_230: J10.230(GPIO14_(PWM)) ; port FAN_PWM

Not connected (* = marked no-connect by the designer): J10 120(CAM1_PWDN)* 122(CAM1_MCLK)*

### Notes on the sheet
- GPIOs, USB2.0, I2S, SPI, GBe and CSI
- uUSB Con
- 90OHM_NETCLASS1
- 4
- 6
- 18
- USB Type-A Con
- M.2 BT
- 10
- 12
- 16
- CAM FPC Con
- 40Pin GPIO HDR
- 50OHM_NETCLASS1
- Audio CodeC
- ETHERNET CON
- 100DIFF_NETCLASS1
- SD_CARD_TestPoint
- 114
- 116
- Camera 0 Clock/Control
- GPIO04
- GPIO00
- GPIO03
- 213
- 215
- GPIOs
- GPIO9
- GPIO08
- GPIO05
- GPIO06
- 50OHM_NETCLASS2
- GPIO10
- GPIO11
- GPIO14

### Library data of the parts
J10 = 2309413-1: Conn DDR4 DIMM Socket SKT 260 POS 0.5mm Solder RA SMD T/R; Manufacturer: TE Connectivity; Supplier 1: Mouser; Manufacturer Part Number: 2309413-1; RoHS: Yes; Category: Memory Connectors; Stock 1: 11271; Pricing 1: 1=1.81000, 10=1.54000, 50=1.54000, 100=1.47000, 1000=1.16000, 10000=1.15000 (USD); ComponentLink1URL: https://www.te.com/commerce/DocumentDelivery/DDEController?Action=srchrtrv&DocNm=2309413&DocType=Customer+Drawing&DocLang=English&src-supplier=Digi-Key; ComponentLink1Description: https://www.te.com/commerce/DocumentDelivery/DDEController?Action=srchrtrv&DocNm=2309413&DocType=Customer+Drawing&DocLang=English&src-supplier=Digi-Key; ComponentLink2URL: https://www.te.com/commerce/DocumentDelivery/DDEController?Action=srchrtrv&amp;DocNm=2309413&amp;DocType=Customer+Drawing&amp;DocLang=English&src-supplier=Digi-Key; ComponentLink2Description: https://www.te.com/commerce/DocumentDelivery/DDEController?Action=srchrtrv&amp;DocNm=2309413&amp;DocType=Customer+Drawing&amp;DocLang=English&src-supplier=Digi-Key; Supplier Part Number 1: 571-2309413-1
R43 R44 = CPF0603B2K2E1: Res Thin Film 0603 2.2K Ohm 0.1% 1/16W ±25ppm/°C Molded SMD SMD Paper T/R; Manufacturer: TE Connectivity Neohm; Resistance: 2.2kR; Power Rating: 63mW; Voltage Rating: 50V; Voltage Rating (DC): 120V; Number of Resistors: 1; Supplier 1: Digi-Key; Manufacturer Part Number: CPF0603B2K2E1; RoHS: Yes; Category: Chip SMD Resistors; Stock 1: 150750; Pricing 1: 1=0.69000, 10=0.49000, 100=0.25450, 500=0.17622 (USD); Mount: Surface Mount; Case/Package: 0603; Number of Pins: 2; Case Code (Imperial): 0603; Case Code (Metric): 1608; Weight: 7.1E-05oz; Min Operating Temperature: -55°C; Max Operating Temperature: 155°C; Tolerance: 0.1%; Packaging: Tape and Reel; Resistor Type: Thin Film; Package Quantity: 1000; Termination: Solder; Temperature Coefficient: 25ppm/°C; Number of Terminations: 2; Series: CPF; Resistance Tolerance: 0.1%; Length: 1.55mm; Width: 0.8mm; Height: 0.45mm; Radiation Hardening: No; Reach SVHC Compliant: Yes; ELV: Compliant; RoHS Compliant: Yes; ComponentLink1URL: https://datasheet.ciiva.com/7789/eng-ds-1773200-j-7789503.pdf?src-supplier=Element14; ComponentLink1Description: https://datasheet.ciiva.com/7789/eng-ds-1773200-j-7789503.pdf?src-supplier=Element14; Supplier Part Number 1: A103077DKR-ND
TP62-TP95 = TestPoint_D1mm

## Sheet Block_HDMI, DP, DSI, USBSS and PCIe.SchDoc
size A3; SheetNumber: 4; SheetTotal: 16
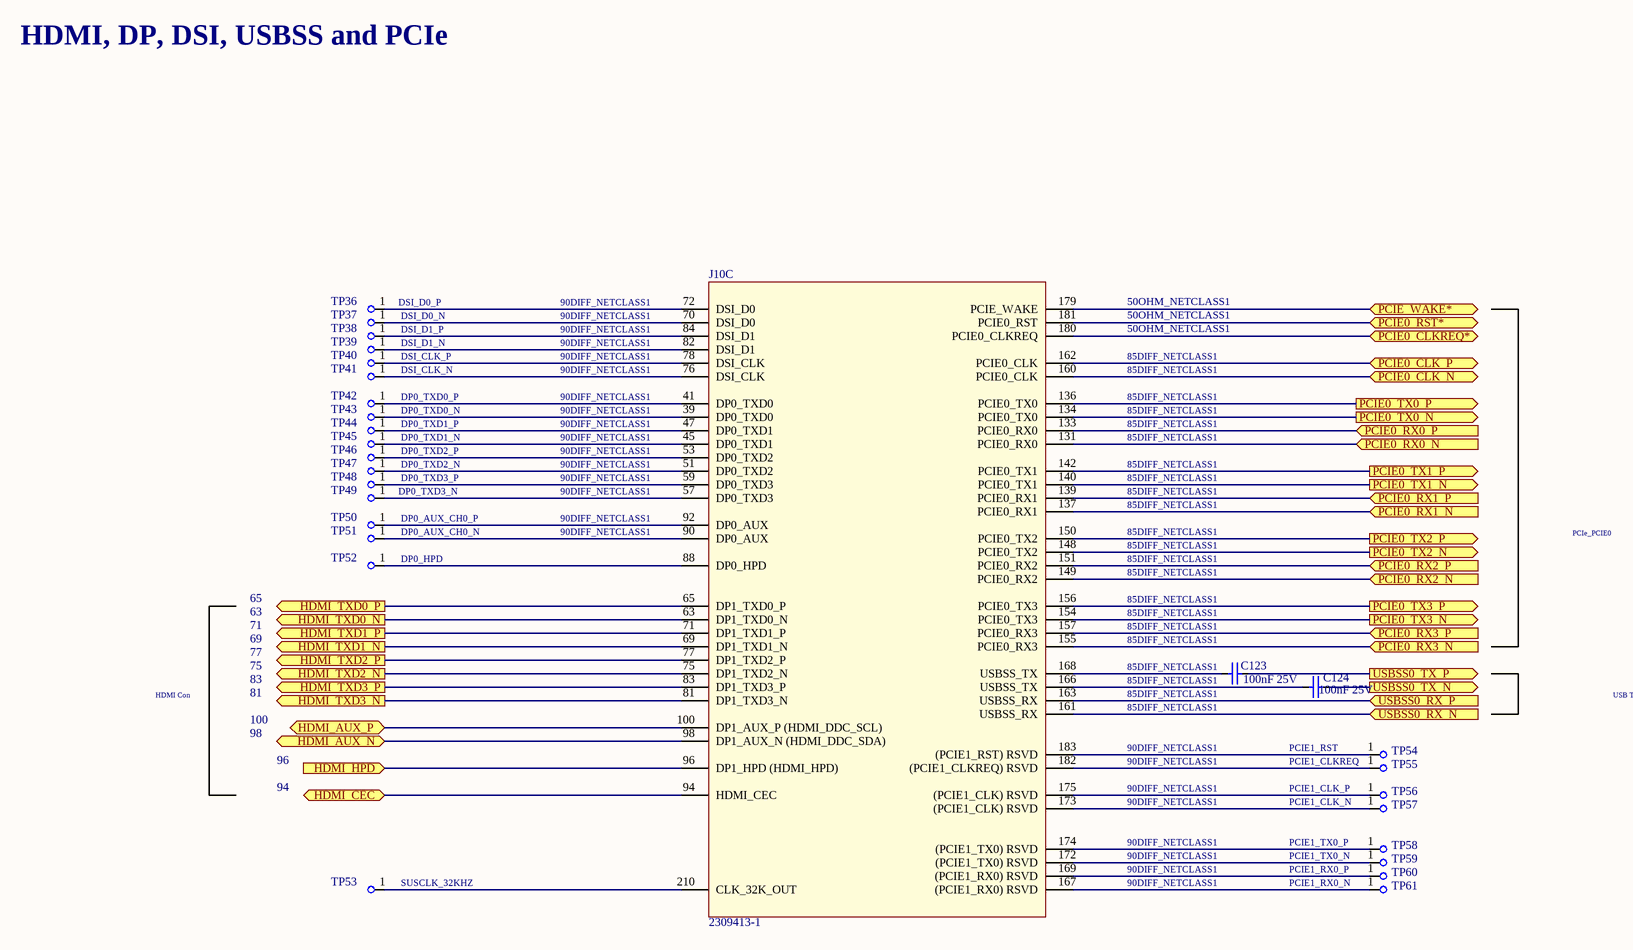
[diagram p2: Block_HDMI, DP, DSI, USBSS and PCIe.SchDoc]

### Parts
C123  100nF 25V  [C0402]
C124  100nF 25V  [C0402]
J10  2309413-1  [2309413-1]  (part C of 3)
TP36  DSI_D0_P  [TestPoint_Pad_D1.0mm]
TP37  DSI_D0_N  [TestPoint_Pad_D1.0mm]
TP38  DSI_D1_P  [TestPoint_Pad_D1.0mm]
TP39  DSI_D1_N  [TestPoint_Pad_D1.0mm]
TP40  DSI_CLK_P  [TestPoint_Pad_D1.0mm]
TP41  DSI_CLK_N  [TestPoint_Pad_D1.0mm]
TP42  DP0_TXD0_P  [TestPoint_Pad_D1.0mm]
TP43  DP0_TXD0_N  [TestPoint_Pad_D1.0mm]
TP44  DP0_TXD1_P  [TestPoint_Pad_D1.0mm]
TP45  DP0_TXD1_N  [TestPoint_Pad_D1.0mm]
TP46  DP0_TXD2_P  [TestPoint_Pad_D1.0mm]
TP47  DP0_TXD2_N  [TestPoint_Pad_D1.0mm]
TP48  DP0_TXD3_P  [TestPoint_Pad_D1.0mm]
TP49  DP0_TXD3_N  [TestPoint_Pad_D1.0mm]
TP50  DP0_AUX_CH0_P  [TestPoint_Pad_D1.0mm]
TP51  DP0_AUX_CH0_N  [TestPoint_Pad_D1.0mm]
TP52  DP0_HPD  [TestPoint_Pad_D1.0mm]
TP53  SUSCLK_32KHZ  [TestPoint_Pad_D1.0mm]
TP54  PCIE1_RST  [TestPoint_Pad_D1.0mm]
TP55  PCIE1_CLKREQ  [TestPoint_Pad_D1.0mm]
TP56  PCIE1_CLK_P  [TestPoint_Pad_D1.0mm]
TP57  PCIE1_CLK_N  [TestPoint_Pad_D1.0mm]
TP58  PCIE1_TX0_P  [TestPoint_Pad_D1.0mm]
TP59  PCIE1_TX0_N  [TestPoint_Pad_D1.0mm]
TP60  PCIE1_RX0_P  [TestPoint_Pad_D1.0mm]
TP61  PCIE1_RX0_N  [TestPoint_Pad_D1.0mm]

### Ports
HDMI_AUX_N (bidir), HDMI_AUX_P (bidir), HDMI_CEC (bidir), HDMI_HPD (in), HDMI_TXD0_N (out), HDMI_TXD0_P (out), HDMI_TXD1_N (out), HDMI_TXD1_P (out), HDMI_TXD2_N (out), HDMI_TXD2_P (out), HDMI_TXD3_N (out), HDMI_TXD3_P (out), PCIE0_CLK_N (bidir), PCIE0_CLK_P (bidir), PCIE0_CLKREQ* (bidir), PCIE0_RST* (bidir), PCIE0_RX0_N (in), PCIE0_RX0_P (in), PCIE0_RX1_N (in), PCIE0_RX1_P (in), PCIE0_RX2_N (in), PCIE0_RX2_P (in), PCIE0_RX3_N (in), PCIE0_RX3_P (in), PCIE0_TX0_N (out), PCIE0_TX0_P (out), PCIE0_TX1_N (out), PCIE0_TX1_P (out), PCIE0_TX2_N (out), PCIE0_TX2_P (out), PCIE0_TX3_N (out), PCIE0_TX3_P (out), PCIE_WAKE* (bidir), USBSS0_RX_N (in), USBSS0_RX_P (in), USBSS0_TX_N (out), USBSS0_TX_P (out)

### Nets
USBSS0_B_TX_N: C124.2 ; port USBSS0_TX_N
USBSS0_B_TX_P: C123.2 ; port USBSS0_TX_P
USBSS0_RX_N: J10.161(USBSS_RX) ; port USBSS0_RX_N
USBSS0_RX_P: J10.163(USBSS_RX) ; port USBSS0_RX_P
NetC42_1: J10.81(DP1_TXD3_N) ; port HDMI_TXD3_N
NetC44_1: J10.83(DP1_TXD3_P) ; port HDMI_TXD3_P
NetC45_1: J10.75(DP1_TXD2_N) ; port HDMI_TXD2_N
NetC46_1: J10.77(DP1_TXD2_P) ; port HDMI_TXD2_P
NetC47_1: J10.69(DP1_TXD1_N) ; port HDMI_TXD1_N
NetC48_1: J10.71(DP1_TXD1_P) ; port HDMI_TXD1_P
NetC49_1: J10.63(DP1_TXD0_N) ; port HDMI_TXD0_N
NetC50_1: J10.65(DP1_TXD0_P) ; port HDMI_TXD0_P
NetC123_1: C123.1 J10.168(USBSS_TX)
NetC124_1: C124.1 J10.166(USBSS_TX)
NetC135_2: J10.136(PCIE0_TX0) ; port PCIE0_TX0_P
NetC136_2: J10.134(PCIE0_TX0) ; port PCIE0_TX0_N
NetC137_2: J10.142(PCIE0_TX1) ; port PCIE0_TX1_P
NetC138_2: J10.140(PCIE0_TX1) ; port PCIE0_TX1_N
NetC139_2: J10.150(PCIE0_TX2) ; port PCIE0_TX2_P
NetC140_2: J10.148(PCIE0_TX2) ; port PCIE0_TX2_N
NetC141_2: J10.156(PCIE0_TX3) ; port PCIE0_TX3_P
NetC142_2: J10.154(PCIE0_TX3) ; port PCIE0_TX3_N
NetD14_1: J10.94(HDMI_CEC) ; port HDMI_CEC
NetJ10_39: J10.39(DP0_TXD0) TP43.1
NetJ10_41: J10.41(DP0_TXD0) TP42.1
NetJ10_45: J10.45(DP0_TXD1) TP45.1
NetJ10_47: J10.47(DP0_TXD1) TP44.1
NetJ10_51: J10.51(DP0_TXD2) TP47.1
NetJ10_53: J10.53(DP0_TXD2) TP46.1
NetJ10_57: J10.57(DP0_TXD3) TP49.1
NetJ10_59: J10.59(DP0_TXD3) TP48.1
NetJ10_70: J10.70(DSI_D0) TP37.1
NetJ10_72: J10.72(DSI_D0) TP36.1
NetJ10_76: J10.76(DSI_CLK) TP41.1
NetJ10_78: J10.78(DSI_CLK) TP40.1
NetJ10_82: J10.82(DSI_D1) TP39.1
NetJ10_84: J10.84(DSI_D1) TP38.1
NetJ10_88: J10.88(DP0_HPD) TP52.1
NetJ10_90: J10.90(DP0_AUX) TP51.1
NetJ10_92: J10.92(DP0_AUX) TP50.1
NetJ10_96: J10.96(DP1_HPD_(HDMI_HPD)) ; port HDMI_HPD
NetJ10_98: J10.98(DP1_AUX_N_(HDMI_DDC_SDA)) ; port HDMI_AUX_N
NetJ10_100: J10.100(DP1_AUX_P_(HDMI_DDC_SCL)) ; port HDMI_AUX_P
NetJ10_131: J10.131(PCIE0_RX0) ; port PCIE0_RX0_N
NetJ10_133: J10.133(PCIE0_RX0) ; port PCIE0_RX0_P
NetJ10_137: J10.137(PCIE0_RX1) ; port PCIE0_RX1_N
NetJ10_139: J10.139(PCIE0_RX1) ; port PCIE0_RX1_P
NetJ10_149: J10.149(PCIE0_RX2) ; port PCIE0_RX2_N
NetJ10_151: J10.151(PCIE0_RX2) ; port PCIE0_RX2_P
NetJ10_155: J10.155(PCIE0_RX3) ; port PCIE0_RX3_N
NetJ10_157: J10.157(PCIE0_RX3) ; port PCIE0_RX3_P
NetJ10_160: J10.160(PCIE0_CLK) ; port PCIE0_CLK_N
NetJ10_162: J10.162(PCIE0_CLK) ; port PCIE0_CLK_P
NetJ10_167: J10.167((PCIE1_RX0)_RSVD) TP61.1
NetJ10_169: J10.169((PCIE1_RX0)_RSVD) TP60.1
NetJ10_172: J10.172((PCIE1_TX0)_RSVD) TP59.1
NetJ10_173: J10.173((PCIE1_CLK)_RSVD) TP57.1
NetJ10_174: J10.174((PCIE1_TX0)_RSVD) TP58.1
NetJ10_175: J10.175((PCIE1_CLK)_RSVD) TP56.1
NetJ10_179: J10.179(PCIE_WAKE) ; port PCIE_WAKE*
NetJ10_180: J10.180(PCIE0_CLKREQ) ; port PCIE0_CLKREQ*
NetJ10_181: J10.181(PCIE0_RST) ; port PCIE0_RST*
NetJ10_182: J10.182((PCIE1_CLKREQ)_RSVD) TP55.1
NetJ10_183: J10.183((PCIE1_RST)_RSVD) TP54.1
NetJ10_210: J10.210(CLK_32K_OUT) TP53.1

### Notes on the sheet
- HDMI, DP, DSI, USBSS and PCIe
- 90DIFF_NETCLASS1
- 50OHM_NETCLASS1
- 85DIFF_NETCLASS1
- PCIe_PCIE0
- 63
- 65
- 83
- 75
- 77
- 69
- 71
- (near C123) 85DIFF_NETCLASS1
- HDMI Con
- 98
- 100
- 81
- USB Type-A Con (USBSS)
- 96
- 94

### Library data of the parts
C123 C124 = TMK105BJ104KV-F: CAP CER 0.1UF 25V X5R 0402 / High Value Multilayer Ceramic Capacitors (High dielectric type); Manufacturer: Taiyo Yuden; Tolerance: 10%; Supplier 1: Digi-Key; Manufacturer Part Number: TMK105BJ104KV-F; RoHS: Yes; Category: Ceramic Capacitors; Stock 1: 11997960; Pricing 1: 1=0.10000, 10=0.03700, 50=0.02000, 100=0.01630, 500=0.01166, 1000=0.00917, 2500=0.00833, 5000=0.00767 (USD); Mount: Surface Mount; Case/Package: 0402; Number of Pins: 2; Case Code (Imperial): 0402; Case Code (Metric): 1005; Weight: 2.3E-05oz; Min Operating Temperature: -55°C; Max Operating Temperature: 85°C; Capacitance: 100nF; Packaging: Tape and Reel; Dielectric: X5R; Voltage Rating (DC): 25V; Voltage Rating: 25V; Package Quantity: 1; Termination: SMD/SMT; Resistor Type: Ceramic; Voltage: 25V; Series: M; Construction: Flat; Length: 1mm; Width: 0.02inch; Height: 0.5mm; Depth: 0.5mm; Thickness: 0.022inch; Reach SVHC Compliant: Yes; Lead Free: Lead Free; Halogen Free: Halogen Free; RoHS Compliant: Yes; Supplier Part Number 1: 587-1456-1-ND
J10 = 2309413-1: as J10 on sheet Block_GPIOs, USB2.0, I2S, SPI, GBe and CSI; Supplier 1: Mouser; Manufacturer Part Number: 2309413-1; RoHS: Yes; Category: Memory Connectors; Stock 1: 11271; Pricing 1: 1=1.81000, 10=1.54000, 50=1.54000, 100=1.47000, 1000=1.16000, 10000=1.15000 (USD); ComponentLink1URL: https://www.te.com/commerce/DocumentDelivery/DDEController?Action=srchrtrv&DocNm=2309413&DocType=Customer+Drawing&DocLang=English&src-supplier=Digi-Key; ComponentLink1Description: https://www.te.com/commerce/DocumentDelivery/DDEController?Action=srchrtrv&DocNm=2309413&DocType=Customer+Drawing&DocLang=English&src-supplier=Digi-Key; ComponentLink2URL: https://www.te.com/commerce/DocumentDelivery/DDEController?Action=srchrtrv&amp;DocNm=2309413&amp;DocType=Customer+Drawing&amp;DocLang=English&src-supplier=Digi-Key; ComponentLink2Description: https://www.te.com/commerce/DocumentDelivery/DDEController?Action=srchrtrv&amp;DocNm=2309413&amp;DocType=Customer+Drawing&amp;DocLang=English&src-supplier=Digi-Key; Supplier Part Number 1: 571-2309413-1
TP36-TP61 = TestPoint_D1mm